# Altium project PumpController.PrjPcb
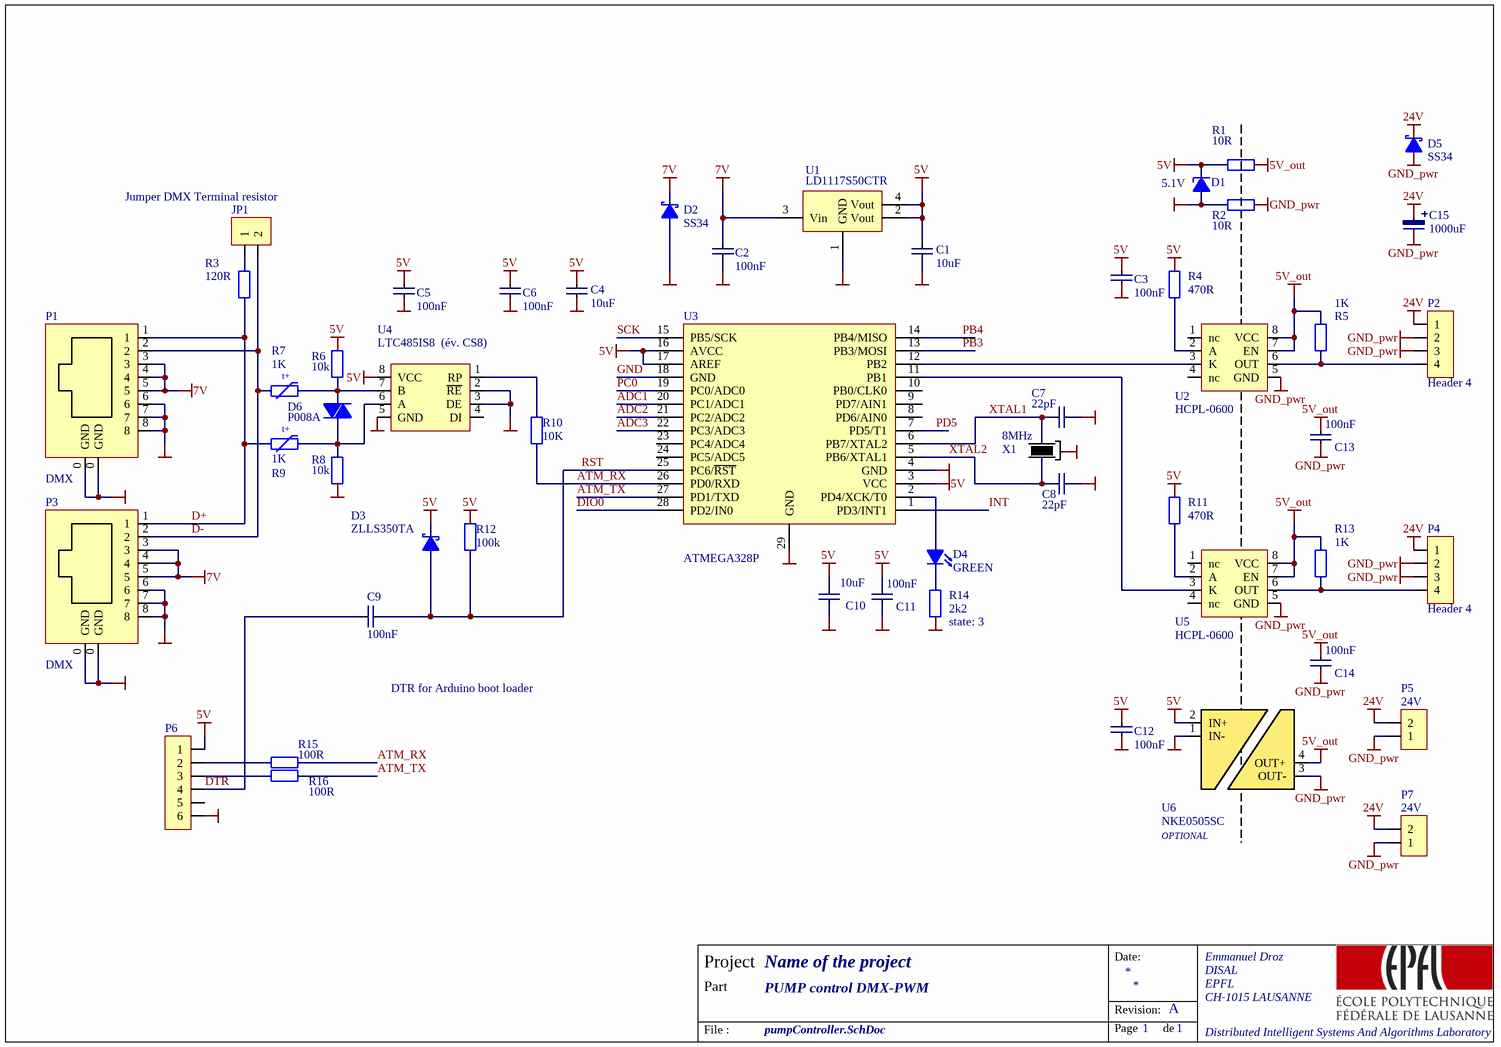
[diagram p0: pumpController.SchDoc]
1 sheet, 52 parts. Net scope: global (net labels, ports and power ports of the same name join across sheets).
Board file: pumpController.PcbDoc

## Sheet pumpController.SchDoc: PUMP control DMX-PWM
size 279 x 195 mm; Organization: Distributed Intelligent Systems And Algorithms Laboratory; Address1: Emmanuel Droz; Address2: DISAL; Address3: EPFL; Address4: CH-1015 LAUSANNE; DocumentNumber: Partie du projet; Revision: A; SheetNumber: 1; SheetTotal: 1; ProjectName: Name of the project

### Parts
C1  10uF  [0805]
C2  100nF  [0603]
C3  100nF  [0603]
C4  10uF  [0805]
C5  100nF  [0603]
C6  100nF  [0603]
C7  22pF  [0603]
C8  22pF  [0603]
C9  100nF  [0603]
C10  10uF  [0805]
C11  100nF  [0603]
C12  100nF  [0603]
C13  100nF  [0603]
C14  100nF  [0603]
C15  1000uF  [CapaRadialD12.5H20F5]
D1  value 5.1V  [MELF]  (hidden comment: not mounted)
D2  SS34  [MELF]
D3  ZLLS350TA  [0603pol]
D4  GREEN  [0805pol]
D5  SS34  [MELF]
D6  P008A  [DO-214]
JP1  Jumper DMX Terminal resistor  [Jumper]
P1  DMX  [RJ45__socket_right]
P2  Header 4  [PHO_3.81_180_4x]
P3  DMX  [RJ45__socket_right]
P4  Header 4  [PHO_3.81_180_4x]
P5  24V  [ALIME 5_08 180]
P6  Header 6  [Header6_1.25_micro_JST_Axial]  (value not drawn)
P7  24V  [ALIME 5_08 180]
R1  10R  [0603]
R2  10R  [0603]
R3  120R  [1206]
R4  470R  [0603]
R5  1K  [0603]
R6  10k  [0603]
R7  1K  [MZ6]
R8  10k  [0603]
R9  1K  [MZ6]
R10  10K  [0603]
R11  470R  [0603]
R12  100k  [0603]
R13  1K  [0603]
R14  state: 3  [0603]  (hidden comment: 2k2)
R15  100R  [0603]
R16  100R  [0603]
U1  LD1117S50CTR  [SOT-223]
U2  HCPL-0600  [so-8]
U3  ATMEGA328P  [ATM328P_MMH]
U4  LTC485IS8  (év. CS8)  [so-8]
U5  HCPL-0600  [so-8]
U6  NKE0505SC  [SIL4]
X1  8MHz  [osc]

### Nets
5V: C1.1 C3.2 C4.1 C5.2 C6.2 C10.1 C11.1 C12.2 D1.2(K) D3.2(K) P6.1 R1.1 R4.1 R6.1 R11.1 R12.2 U1.2(Vout) U1.4(N/C) U3.3(VCC) U3.16(AVCC) U3.17(AREF) U4.8(VCC) U6.2(IN+)
5V_out: C13.1 C14.1 R1.2 R5.1 R13.1 U2.7(EN) U2.8(VCC) U5.7(EN) U5.8(VCC) U6.4(OUT+)
7V: C2.2 D2.2(K) P1.3 P1.4 P1.5 P3.3 P3.4 P3.5 U1.3(Vin)
24V: C15.2 D5.2(K) P2.1 P4.1 P5.2 P7.2
GND: C1.2 C2.1 C3.1 C4.2 C5.1 C6.1 C7.2 C8.2 C10.2 C11.2 C12.1 D1.1(A) D2.1(A) P1.0(GND) P1.6 P1.7 P1.8 P3.0(GND) P3.6 P3.7 P3.8 P6.6 R2.1 R8.2 R14.2 U1.1(GND) U3.4(GND) U3.18(GND) U3.29(GND) U4.2(~{RE}) U4.3(DE) U4.5(GND) U6.1(IN-) X1.3
GND_pwr: C13.2 C14.2 C15.1 D5.1(A) P2.2 P2.3 P4.2 P4.3 P5.1 P7.1 R2.2 U2.5(GND) U5.5(GND) U6.3(OUT-)
ADC1: U3.20(PC1/ADC1)
ADC2: U3.21(PC2/ADC2)
ADC3: U3.22(PC3/ADC3)
ATM_RX: R10.2 R15.2 U3.26(PD0/RXD)
ATM_TX: R16.2 U3.27(PD1/TXD)
D+: P1.1 P3.1 R3.2 R9.1
D-: JP1.2 P1.2 P3.2 R7.1
DIO0: U3.28(PD2/IN0)
DTR: C9.2 P6.4
INT: U3.1(PD3/INT1)
PB3: U3.13(PB3/MOSI)
PB4: U3.14(PB4/MISO)
PC0: U3.19(PC0/ADC0)
PD5: U3.7(PD5/T1)
RST: C9.1 D3.1(A) R12.1 U3.25(PC6/~{RST})
SCK: U3.15(PB5/SCK)
XTAL1: C7.1 U3.6(PB7/XTAL2) X1.1
XTAL2: C8.1 U3.5(PB6/XTAL1) X1.2
NetD4_1: D4.1(A) U3.2(PD4/XCK/T0)
NetD4_2: D4.2(K) R14.1
NetD6_1: D6.1(A) R6.2 R7.2 U4.7(B)
NetD6_2: D6.2(K) R8.1 R9.2 U4.6(A)
NetJP1_1: JP1.1 R3.1
NetP2_4: P2.4 R5.2 U2.6(OUT)
NetP4_4: P4.4 R13.2 U5.6(OUT)
NetP6_2: P6.2 R15.1
NetP6_3: P6.3 R16.1
NetR4_2: R4.2 U2.2(A)
NetR10_1: R10.1 U4.1(RP)
NetR11_2: R11.2 U5.2(A)
NetU2_3: U2.3(K) U3.12(PB2)
NetU3_11: U3.11(PB1) U5.3(K)

Not connected (* = marked no-connect by the designer): P6 5; U2 1(nc) 4(nc); U3 8(PD6/AIN0) 9(PD7/AIN1) 10(PB0/CLK0) 23(PC4/ADC4) 24(PC5/ADC5); U4 4(DI); U5 1(nc) 4(nc)

### Notes on the sheet
- DTR for Arduino boot loader
- OPTIONAL
- Project
- Part
- Date:
- File :
- Revision:
- Page
- de
- (in symbol R_ptc) t+

### Library data of the parts
C1 C4 C10 = C: Capacitor; name: C2012X5R1A106K125AB; value: 10uF
C2 C3 C5 C6 C12 = C: Capacitor; name: C100nF25V0603X7R; name: R0603Set; value: 100nF
C7 C8 = C: Capacitor; name: C0603Set; value: 22pF
C9 C11 C13 C14 = C: Capacitor; name: C100nF25V0603X7R; value: 100nF
C15 = Cp: Capacitor; name: UVR1V102MHD; value: 1000uF
D1 = D_Zener: Diode; name: Zener5V
D2 D5 = SMS120: Schottky Diode 1A 0.5V 20V; name: SS34
D3 = D_schottky: Shottky diode; name: ZLLS350TA
D4 = LED: LED green; name: OVS-0804; value: GREEN; status: 4; Supplier 1: Farnell; Supplier Part Number 1: 1716766
D6 = D_Diac: Diac; name: P008A
JP1 = Header 2: Header, 4-Pin, Dual row; name: connectorJumper
P1 P3 = RJ45: name: RJ45__socket_right
P2 P4 = Header 4: Header, 4-Pin, single row; name: CON_phoenix_3.81_180_4x; LatestRevisionDate: 17-Jul-2002; LatestRevisionNote: Re-released for DXP Platform.; Publisher: Altium Limited
P5 P7 = Header 2: Header, 4-Pin, Dual row; name: CON_phoenix_5.01_180_2x; LatestRevisionDate: 17-Jul-2002; LatestRevisionNote: Re-released for DXP Platform.; Publisher: Altium Limited
P6 = Header 6: Header,6-Pin; name: Header6_1.25_90deg_smd_Micro_JST; LatestRevisionDate: 17-Jul-2002; LatestRevisionNote: Re-released for DXP Platform.; Publisher: Altium Limited
R1 = R: Resistor; name: R0603Set; value: 100R
R2 R4-R6 R8 R10-R14 = R: Resistor; name: R0603Set
  R2: value: 10R
  R4 R11: Value: 470R
  R5 R13: Value: 1K
  R6 R8: Value: 10k
  R10: Value: 10K
  R12: Value: 100k
  R14: Value: 2k2
R3 = R: Resistor; name: R1206Set; Value: 120R
R7 R9 = R_ptc: Resistor PTC; Value: 1K; name: MZ6
R15 R16 = R: Resistor; Value: 100k; name: R0603Set
U1 = STAB_x17: Linear regulator; value: 5V; name: LD1117S50CTR
U2 U5 = HCPL-0600: Logical optocoupler single SO8; name: HCPL-0600
U3 = ATM328P: name: ATMEGA328P
U4 = LTC485CS8: name: SP485EE
U6 = DCDCisolated: Isolated power supply; name: NKE0505SC
X1 = Quartz: name: Quartz_8MHz_smd; value: 8MHz